# Altium schematic sheet Main.SchDoc
size A3; SheetNumber: 1; SheetTotal: 10; ENG_APP_DATE: --/--/--; DSN_APP_DATE: --/--/--; CHK_APP_DATE: --/--/--
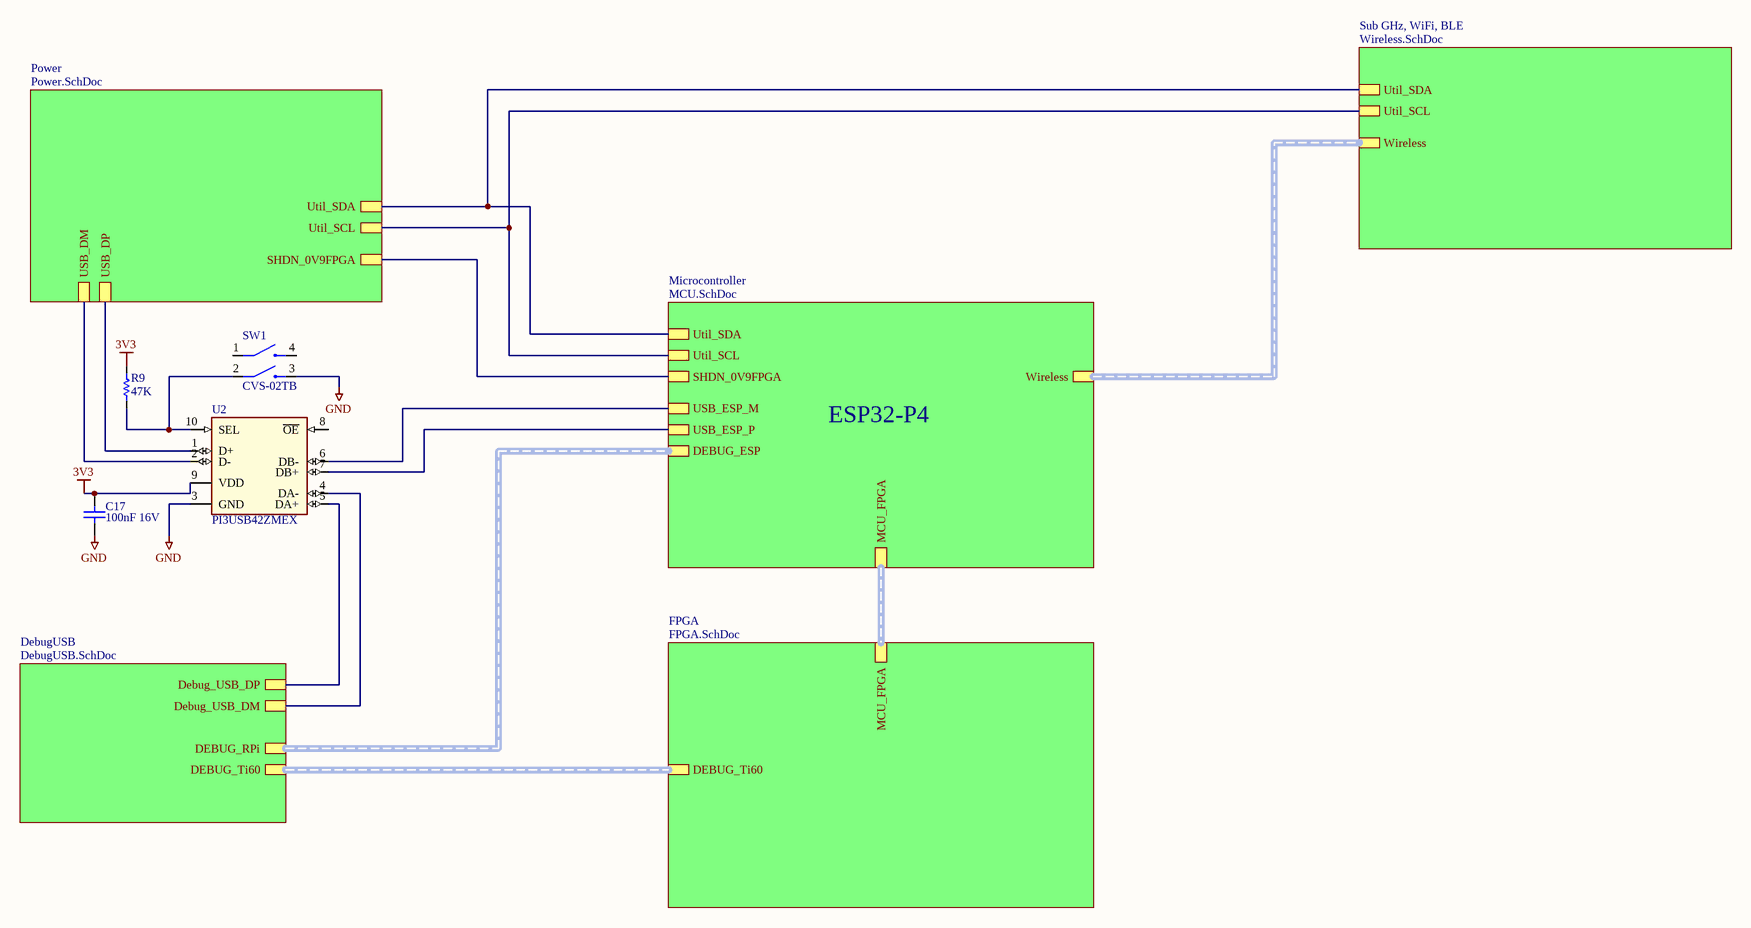
[diagram p0: Main.SchDoc]

## Parts
C17  100nF 16V  [0402]
R9  47K  [0603 Resistor]
SW1  CVS-02TB  [CVS-02TB-Footprint-1]
U2  PI3USB42ZMEX  [QFN40P140X180X60-10N]

## Sub-sheets
DebugUSB = DebugUSB.SchDoc: DEBUG_Ti60 (harness DEBUG_Ti60), DEBUG_RPi (harness DEBUG_RPi), Debug_USB_DM, Debug_USB_DP
FPGA = FPGA.SchDoc: DEBUG_Ti60, MCU_FPGA
Microcontroller = MCU.SchDoc: Util_SDA, Util_SCL, DEBUG_ESP (harness DEBUG_P4), Wireless (harness Wireless), USB_ESP_M, USB_ESP_P, MCU_FPGA (harness MCU_FPGA), SHDN_0V9FPGA
Power = Power.SchDoc: Util_SDA, Util_SCL, USB_DP, USB_DM, SHDN_0V9FPGA
Sub GHz, WiFi, BLE = Wireless.SchDoc: Wireless (harness Wireless), Util_SDA, Util_SCL

## Nets
3V3: C17.2 R9.1 U2.9(VDD)
GND: C17.1 SW1.3 U2.3(GND)
NetR9_2: R9.2 SW1.2 U2.10(SEL)
NetU2_1: U2.1(D+) ; sheet Power/USB_DP
NetU2_2: U2.2(D-) ; sheet Power/USB_DM
NetU2_4: U2.4(DA-) ; sheet DebugUSB/Debug_USB_DM
NetU2_5: U2.5(DA+) ; sheet DebugUSB/Debug_USB_DP
NetU2_6: U2.6(DB-) ; sheet Microcontroller/USB_ESP_M
NetU2_7: U2.7(DB+) ; sheet Microcontroller/USB_ESP_P
(unnamed): sheet Microcontroller/Util_SDA, sheet Power/Util_SDA, sheet Sub GHz, WiFi, BLE/Util_SDA
(unnamed): sheet Microcontroller/Util_SCL, sheet Power/Util_SCL, sheet Sub GHz, WiFi, BLE/Util_SCL
(unnamed): sheet Microcontroller/SHDN_0V9FPGA, sheet Power/SHDN_0V9FPGA

Not connected (* = marked no-connect by the designer): SW1 1 4; U2 8(~{OE})

## Buses and harness runs
harness sheet DebugUSB/DEBUG_RPi = sheet Microcontroller/DEBUG_ESP
harness sheet DebugUSB/DEBUG_Ti60 = sheet FPGA/DEBUG_Ti60
harness sheet FPGA/MCU_FPGA = sheet Microcontroller/MCU_FPGA
harness sheet Microcontroller/Wireless = sheet Sub GHz, WiFi, BLE/Wireless

## Notes on the sheet
- ESP32-P4
- Project:
- Title:
- Sheet number:
- Revision:
- Designer:
- out of
- Date:

## Library data of the parts
C17 = CMP-00017-A.2
R9 = CMP-001-B87-6: 47K, 1%, 1/10W, 0603
SW1 = CMP-001-L08-A.1: SWITCH SLIDE DIP SPST 100MA 6V; Pitch: 0.039inch; Electrical Life: 1000Cycles; Body Material: Polyphenylene; Actuator Type: Slide (Standard); Number of Positions: 2; Washable: No; Min Operating Temperature: -40°C; Max Operating Temperature: 85°C; Current Rating: 100mA; Length: 0.118inch; Termination: Gull Wing; Contact Plating: Gold; Voltage Rating (DC): 6V; Mount: Surface Mount; Contact Material: Stainless Steel; Throw Configuration: SPST; Packaging: Tape and Reel
U2 = PI3USB42ZMEX: USB Switch IC 1 Channel 10-UQFN (1.8x1.4); MF: Diodes Inc.; MP: PI3USB42ZMEX; Value: *; Availability: Unavailable; Package: UQFN-10 Diodes Inc.; SnapEDA_Link: https://www.snapeda.com/parts/PI3USB42ZMEX/Diodes%20Inc./view-part/1218281/?ref=snap; Price: None